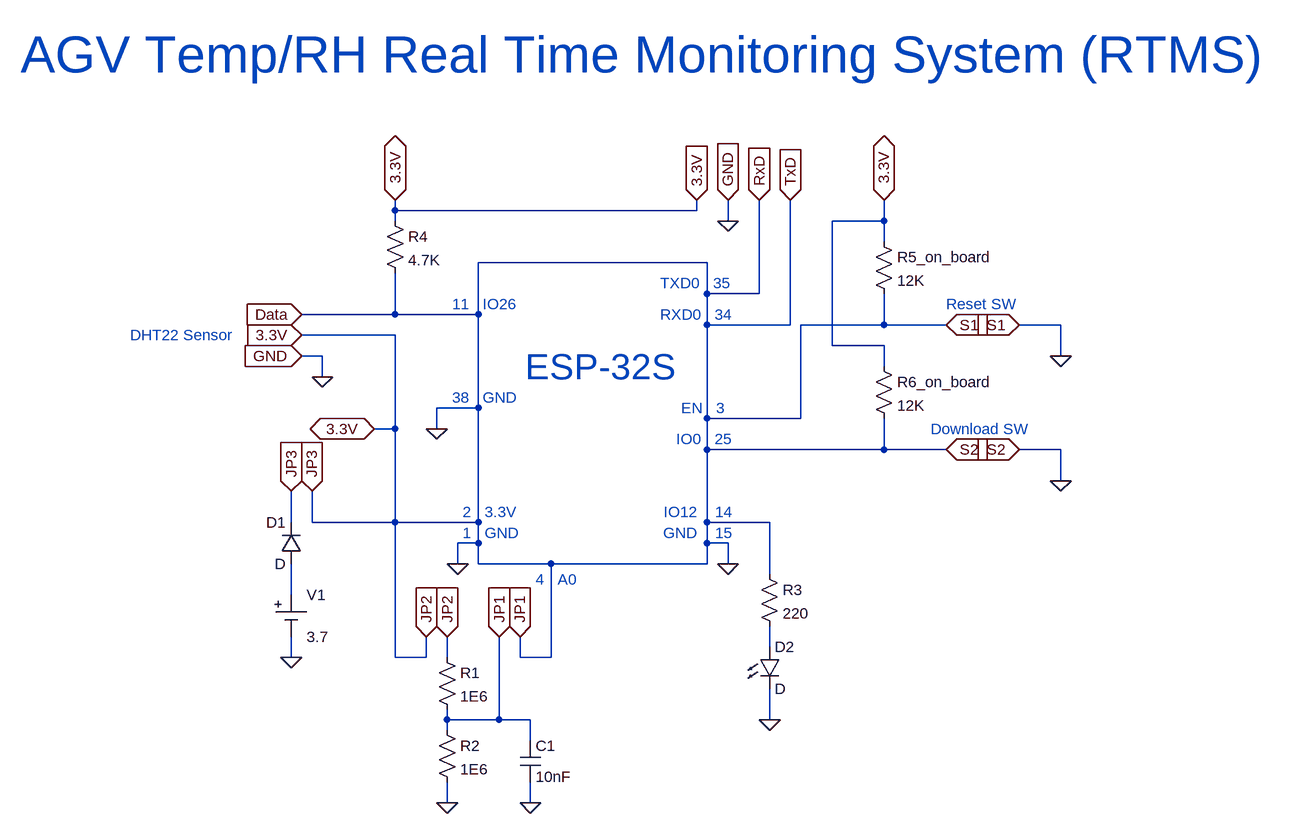
[diagram p0: schematic Schemetic.asc]
Schemetic.asc, the LTspice schematic file:
Version 4
SHEET 1 1844 680
WIRE -128 -480 -128 -496
WIRE 336 -480 336 -496
WIRE 336 -480 -128 -480
WIRE -128 -464 -128 -480
WIRE 384 -464 384 -496
WIRE 624 -464 624 -496
WIRE 624 -464 544 -464
WIRE 624 -432 624 -464
WIRE 352 -400 0 -400
WIRE 352 -352 352 -400
WIRE 432 -352 432 -496
WIRE 432 -352 352 -352
WIRE -128 -320 -128 -384
WIRE -128 -320 -272 -320
WIRE 0 -320 0 -400
WIRE 0 -320 -128 -320
WIRE 352 -304 352 -352
WIRE 480 -304 480 -496
WIRE 480 -304 352 -304
WIRE 624 -304 624 -352
WIRE 624 -304 496 -304
WIRE 720 -304 624 -304
WIRE 896 -304 832 -304
WIRE -128 -288 -272 -288
WIRE 544 -272 544 -464
WIRE 624 -272 544 -272
WIRE -240 -256 -272 -256
WIRE 896 -256 896 -304
WIRE 624 -240 624 -272
WIRE -240 -224 -240 -256
WIRE 0 -176 0 -320
WIRE 0 -176 -64 -176
WIRE 352 -160 352 -304
WIRE 496 -160 496 -304
WIRE 496 -160 352 -160
WIRE -128 -144 -128 -288
WIRE -128 -144 -160 -144
WIRE -64 -144 -64 -176
WIRE 352 -112 352 -160
WIRE 624 -112 624 -160
WIRE 624 -112 352 -112
WIRE 720 -112 624 -112
WIRE 896 -112 832 -112
WIRE 896 -64 896 -112
WIRE -288 0 -288 -48
WIRE -256 0 -256 -48
WIRE -128 0 -128 -144
WIRE -128 0 -256 0
WIRE 0 0 0 -176
WIRE 0 0 -128 0
WIRE 352 0 352 -112
WIRE 448 0 352 0
WIRE 0 32 0 0
WIRE 0 32 -32 32
WIRE 352 32 352 0
WIRE 384 32 352 32
WIRE -32 64 -32 32
WIRE 0 64 0 32
WIRE 112 64 0 64
WIRE 352 64 352 32
WIRE 352 64 112 64
WIRE 384 64 384 32
WIRE 448 80 448 0
WIRE -288 112 -288 64
WIRE 448 192 448 160
WIRE -288 208 -288 176
WIRE -128 208 -128 0
WIRE -80 208 -80 176
WIRE -80 208 -128 208
WIRE -48 208 -48 176
WIRE 64 208 64 176
WIRE 112 208 112 64
WIRE 112 208 64 208
WIRE -48 304 -48 288
WIRE 32 304 32 176
WIRE 32 304 -48 304
WIRE 80 304 32 304
WIRE 448 304 448 256
WIRE -48 320 -48 304
WIRE 80 336 80 304
WIRE -48 432 -48 400
WIRE 80 432 80 400
FLAG -288 -48 JP3
IOPIN -288 -48 In
FLAG -256 -48 JP3
IOPIN -256 -48 In
FLAG -288 208 0
FLAG -80 176 JP2
IOPIN -80 176 In
FLAG -48 176 JP2
IOPIN -48 176 In
FLAG -48 432 0
FLAG 80 432 0
FLAG 32 176 JP1
IOPIN 32 176 In
FLAG 64 176 JP1
IOPIN 64 176 In
FLAG -32 64 0
FLAG 448 304 0
FLAG 384 64 0
FLAG -272 -320 Data
IOPIN -272 -320 In
FLAG -272 -288 3.3V
IOPIN -272 -288 In
FLAG -272 -256 GND
IOPIN -272 -256 In
FLAG -240 -224 0
FLAG -160 -144 3.3V
IOPIN -160 -144 BiDir
FLAG -128 -496 3.3V
IOPIN -128 -496 BiDir
FLAG 624 -496 3.3V
IOPIN 624 -496 BiDir
FLAG 720 -304 S1
IOPIN 720 -304 In
FLAG 832 -304 S1
IOPIN 832 -304 In
FLAG 896 -256 0
FLAG 720 -112 S2
IOPIN 720 -112 In
FLAG 832 -112 S2
IOPIN 832 -112 In
FLAG 896 -64 0
FLAG 336 -496 3.3V
IOPIN 336 -496 In
FLAG 384 -496 GND
IOPIN 384 -496 In
FLAG 432 -496 RxD
IOPIN 432 -496 In
FLAG 480 -496 TxD
IOPIN 480 -496 In
FLAG 384 -464 0
FLAG -64 -144 0
SYMBOL Misc\\cell -288 112 R0
WINDOW 123 0 0 Left 0
WINDOW 39 0 0 Left 0
SYMATTR InstName V1
SYMATTR Value 3.7
SYMBOL diode -272 64 R180
WINDOW 0 24 64 Left 2
WINDOW 3 24 0 Left 2
SYMATTR InstName D1
SYMBOL res -64 192 R0
SYMATTR InstName R1
SYMATTR Value 1E6
SYMBOL res -64 304 R0
SYMATTR InstName R2
SYMATTR Value 1E6
SYMBOL cap 64 336 R0
SYMATTR InstName C1
SYMATTR Value 10nF
SYMBOL res 432 64 R0
SYMATTR InstName R3
SYMATTR Value 220
SYMBOL LED 432 192 R0
SYMATTR InstName D2
SYMBOL res -144 -480 R0
SYMATTR InstName R4
SYMATTR Value 4.7K
SYMBOL res 608 -448 R0
SYMATTR InstName R5_on_board
SYMATTR Value 12K
SYMBOL res 608 -256 R0
SYMATTR InstName R6_on_board
SYMATTR Value 12K
TEXT -24 -16 Left 2 ;2   3.3V
TEXT -24 16 Left 2 ;1   GND
TEXT 88 88 Left 2 ;4   A0
TEXT 392 -16 Right 2 ;IO12    14
TEXT 392 16 Right 2 ;GND    15
TEXT -536 -288 Left 2 ;DHT22 Sensor
TEXT -40 -336 Left 2 ;11   IO26
TEXT 720 -336 Left 2 ;Reset SW
TEXT 696 -144 Left 2 ;Download SW
TEXT 280 -368 Left 2 ;TXD0   35
TEXT 280 -320 Left 2 ;RXD0   34
TEXT 312 -176 Left 2 ;EN   3
TEXT 304 -128 Left 2 ;IO0   25
TEXT 72 -240 Left 5 ;ESP-32S
TEXT -40 -192 Left 2 ;38   GND
TEXT -704 -720 Left 6 ;AGV Temp/RH Real Time Monitoring System (RTMS)

The netlist it stands for:
* Schemetic.asc
V1 N001 0 3.7
D1 N001 0 D
R1 0 0 1E6
R2 0 0 1E6
C1 0 0 10nF
R3 0 N002 220
D2 N002 0 D
R4 0 0 4.7K
R5_on_board 0 0 12K
R6_on_board 0 0 12K
.model D D
.lib standard.dio
* 2   3.3V
* 1   GND
* 4   A0
* IO12    14
* GND    15
* DHT22 Sensor
* 11   IO26
* Reset SW
* Download SW
* TXD0   35
* RXD0   34
* EN   3
* IO0   25
* ESP-32S
* 38   GND
* AGV Temp/RH Real Time Monitoring System (RTMS)
.backanno
.end